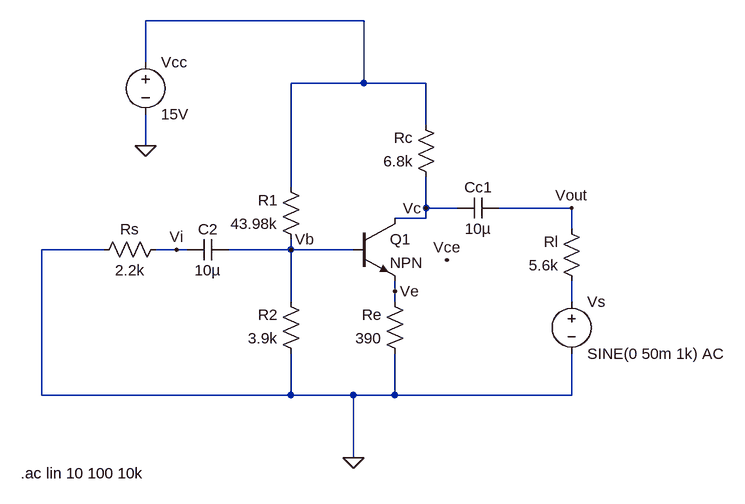
[diagram p0: schematic output_resistance.asc]
output_resistance.asc, the LTspice schematic file:
Version 4
SHEET 1 1024 680
WIRE 464 -288 128 -288
WIRE 128 -224 128 -288
WIRE 464 -192 464 -288
WIRE 464 -192 352 -192
WIRE 560 -192 464 -192
WIRE 560 -128 560 -192
WIRE 128 -96 128 -144
WIRE 352 -32 352 -192
WIRE 560 0 560 -48
WIRE 608 0 560 0
WIRE 784 0 672 0
WIRE 560 16 560 0
WIRE 560 16 512 16
WIRE 784 32 784 0
WIRE 64 64 -32 64
WIRE 176 64 144 64
WIRE 192 64 176 64
WIRE 352 64 352 48
WIRE 352 64 256 64
WIRE 448 64 352 64
WIRE 512 128 512 112
WIRE 352 144 352 64
WIRE 512 144 512 128
WIRE 784 144 784 112
WIRE -32 288 -32 64
WIRE 352 288 352 224
WIRE 352 288 -32 288
WIRE 448 288 352 288
WIRE 512 288 512 224
WIRE 512 288 448 288
WIRE 784 288 784 224
WIRE 784 288 512 288
WIRE 448 384 448 288
FLAG 128 -96 0
FLAG 448 384 0
FLAG 352 64 Vb
FLAG 176 64 Vi
FLAG 512 128 Ve
FLAG 592 80 Vce
FLAG 560 0 Vc
FLAG 784 0 Vout
SYMBOL res 160 48 R90
WINDOW 0 0 56 VBottom 2
WINDOW 3 32 56 VTop 2
SYMATTR InstName Rs
SYMATTR Value 2.2k
SYMBOL res 368 64 R180
WINDOW 0 36 76 Left 2
WINDOW 3 36 40 Left 2
SYMATTR InstName R1
SYMATTR Value 43.98k
SYMBOL res 576 -32 R180
WINDOW 0 36 76 Left 2
WINDOW 3 36 40 Left 2
SYMATTR InstName Rc
SYMATTR Value 6.8k
SYMBOL cap 256 48 R90
WINDOW 0 0 32 VBottom 2
WINDOW 3 32 32 VTop 2
SYMATTR InstName C2
SYMATTR Value 10µ
SYMBOL cap 672 -16 R90
WINDOW 0 0 32 VBottom 2
WINDOW 3 32 32 VTop 2
SYMATTR InstName Cc1
SYMATTR Value 10µ
SYMBOL res 368 240 R180
WINDOW 0 36 76 Left 2
WINDOW 3 36 40 Left 2
SYMATTR InstName R2
SYMATTR Value 3.9k
SYMBOL voltage 128 -240 R0
WINDOW 123 0 0 Left 0
WINDOW 39 0 0 Left 0
SYMATTR InstName Vcc
SYMATTR Value 15V
SYMBOL npn 448 16 R0
SYMATTR InstName Q1
SYMBOL res 528 240 R180
WINDOW 0 36 76 Left 2
WINDOW 3 36 40 Left 2
SYMATTR InstName Re
SYMATTR Value 390
SYMBOL res 800 128 R180
WINDOW 0 36 76 Left 2
WINDOW 3 36 40 Left 2
SYMATTR InstName Rl
SYMATTR Value 5.6k
SYMBOL voltage 784 128 R0
WINDOW 123 0 0 Left 0
WINDOW 39 0 0 Left 0
SYMATTR InstName Vs
SYMATTR Value SINE(0 50m 1k) AC
TEXT -64 408 Left 2 !.ac lin 10 100 10k

The netlist it stands for:
* output_resistance.asc
Rs Vi 0 2.2k
R1 Vb N001 43.98k
Rc Vc N001 6.8k
C2 Vb Vi 10µ
Cc1 Vout Vc 10µ
R2 0 Vb 3.9k
Vcc N001 0 15V
Q1 Vc Vb Ve 0 NPN
Re 0 Ve 390
Rl N002 Vout 5.6k
Vs N002 0 SINE(0 50m 1k) AC
.model NPN NPN
.model PNP PNP
.lib standard.bjt
.ac lin 10 100 10k
.backanno
.end